# EAGLE design pcb (EAGLE 6.1)
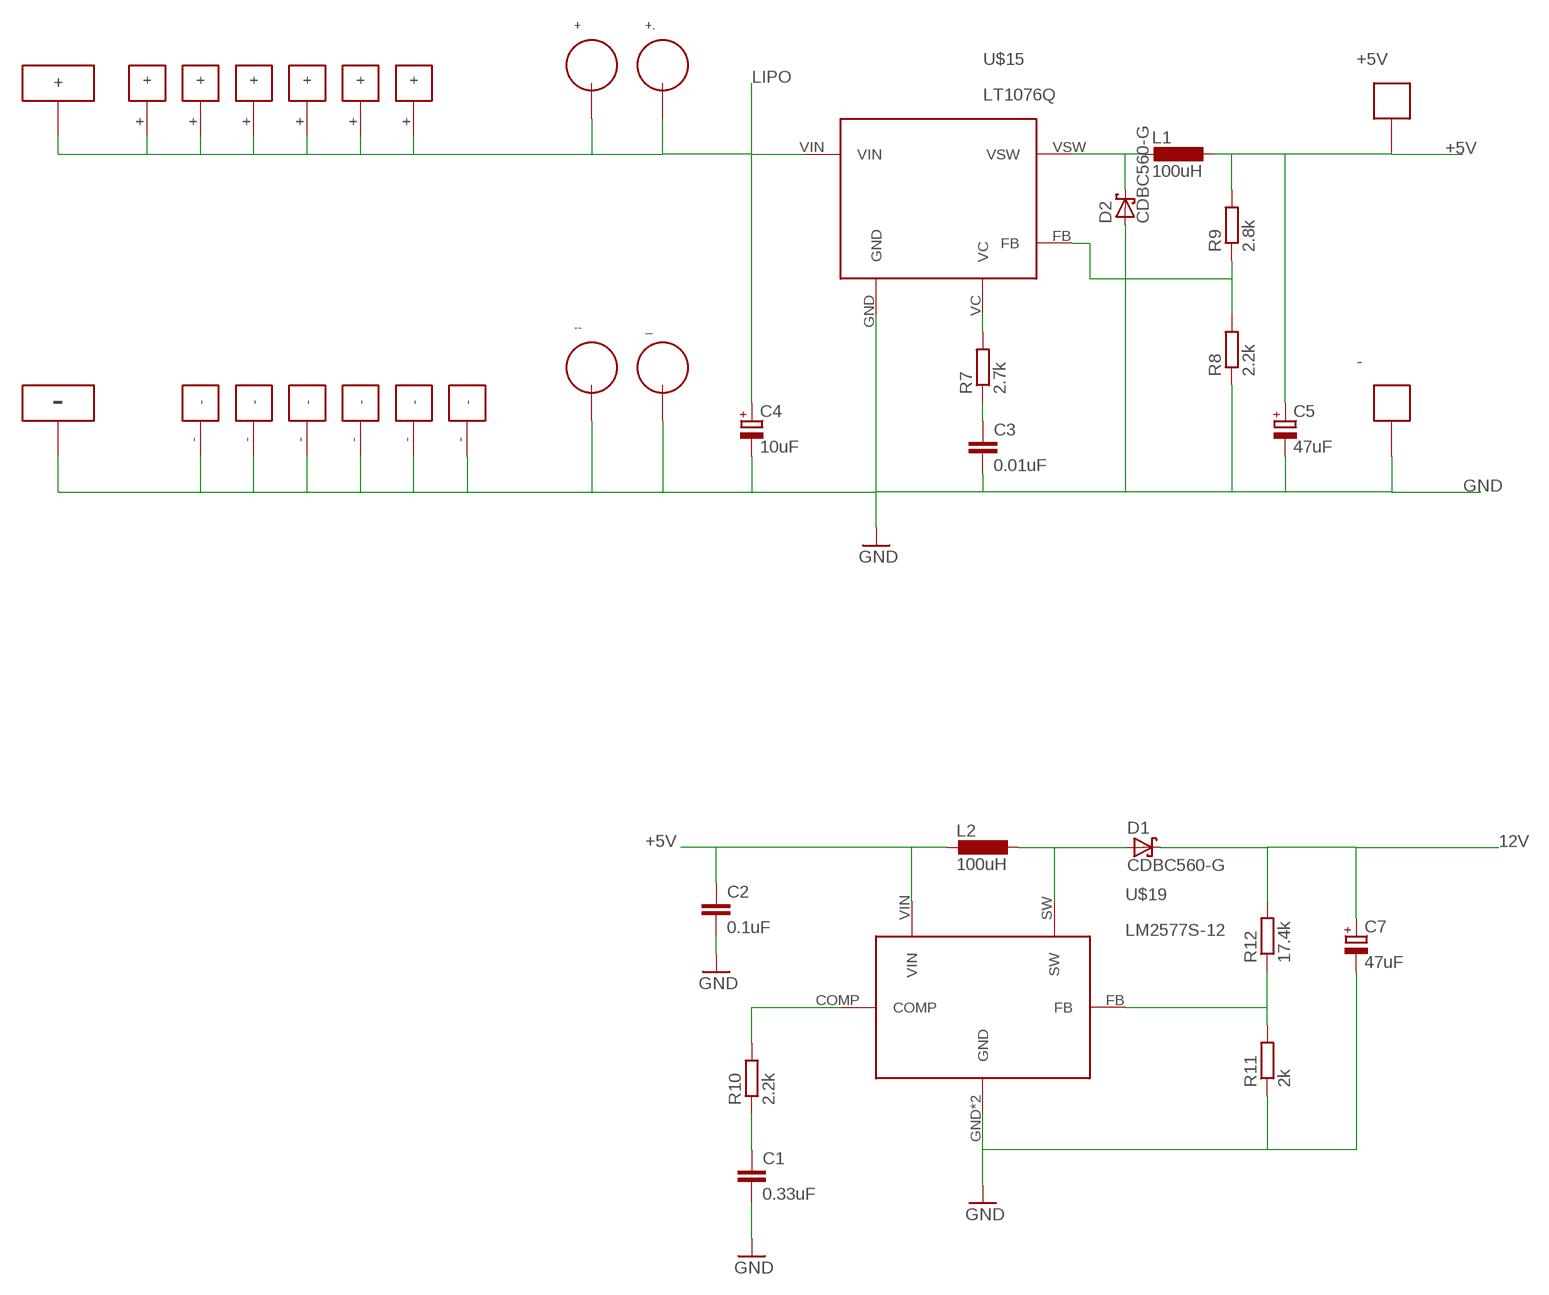
[diagram p0: schematic, sheet 1, part 1 of 2]
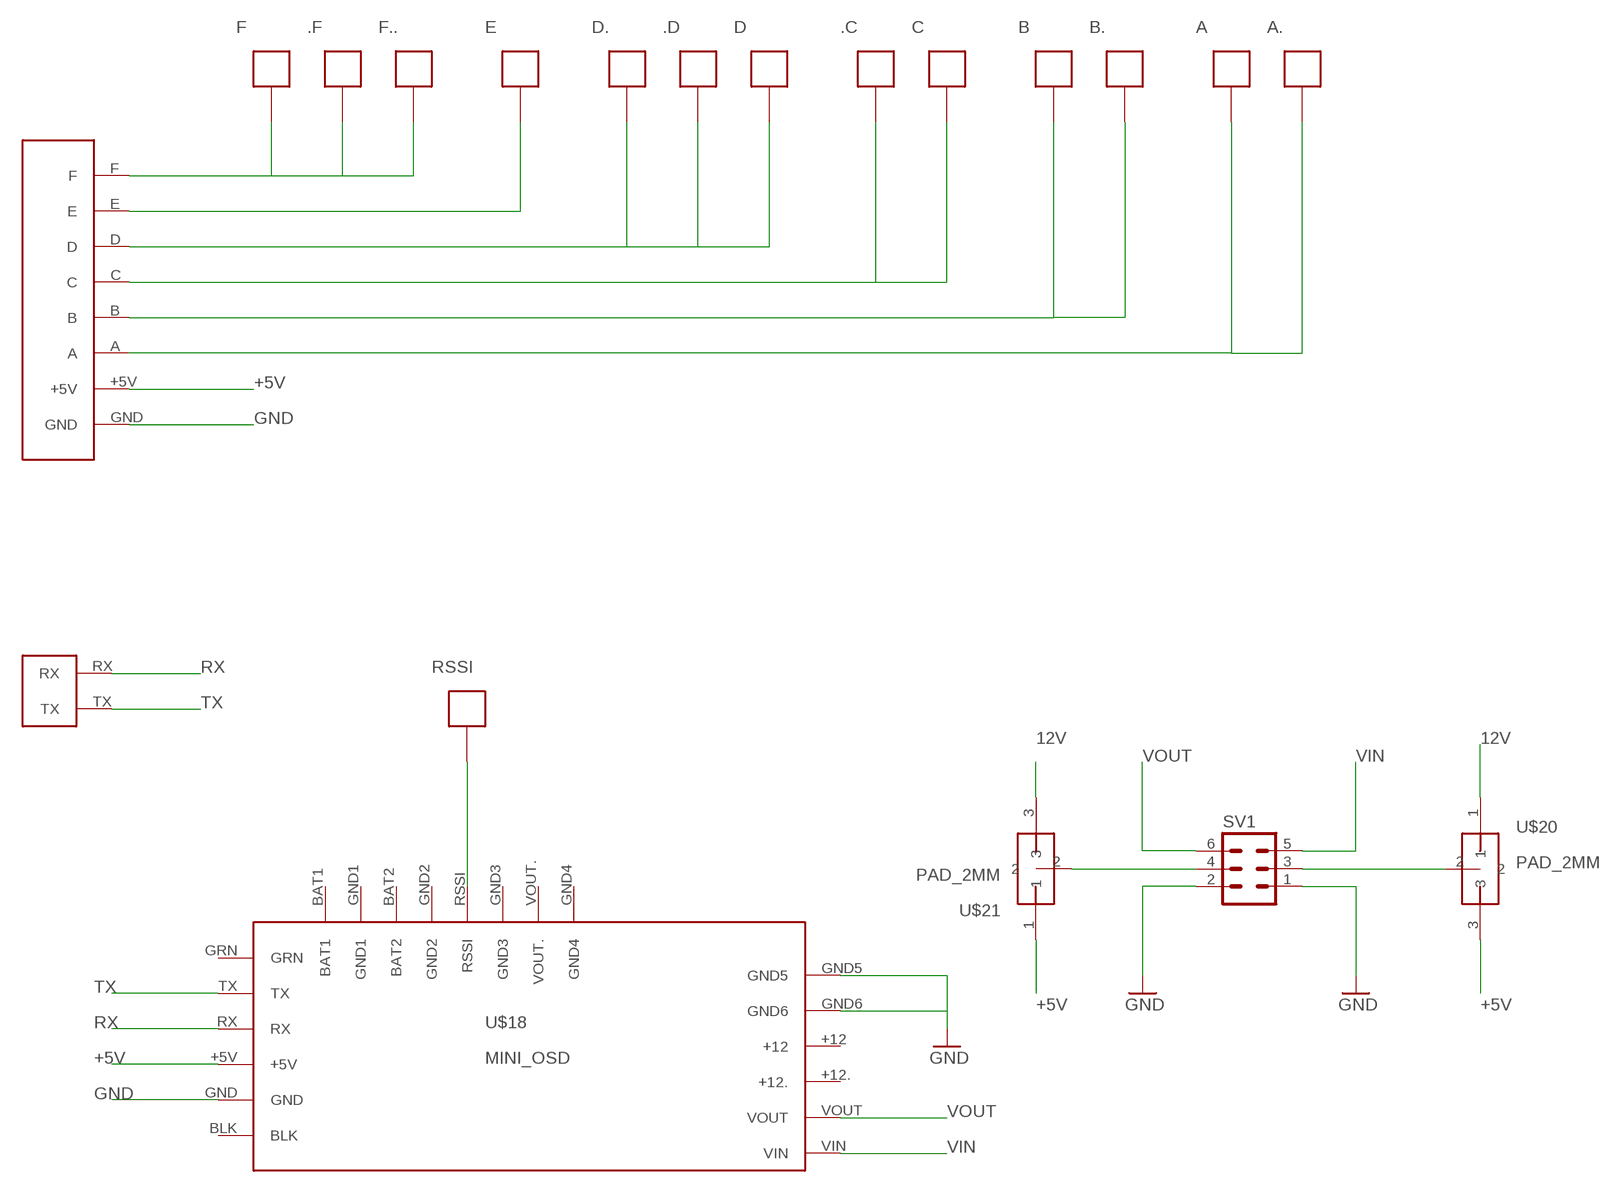
[diagram p1: schematic, sheet 1, part 2 of 2]

## Parts
+  PAD_POWER  [PAD_POWER]
+5V  PAD3-A  [PAD3-A]
+.  PAD_POWER  [PAD_POWER]
-  PAD3-A  [PAD3-A]
--  PAD_POWER  [PAD_POWER]
.C  PAD3-A  [PAD3-A]
.D  PAD3-A  [PAD3-A]
.F  PAD3-A  [PAD3-A]
_  PAD_POWER  [PAD_POWER]
A  PAD3-A  [PAD3-A]
A.  PAD3-A  [PAD3-A]
B  PAD3-A  [PAD3-A]
B.  PAD3-A  [PAD3-A]
C  PAD3-A  [PAD3-A]
C1  0.33uF  C-EUC1206  [C1206]
C2  0.1uF  C-EUC1206  [C1206]
C3  0.01uF  C-EUC1206  [C1206]
C4  10uF  CPOL-EU153CLV-0505  [153CLV-0505]
C5  47uF  CPOL-EU153CLV-0505  [153CLV-0505]
C7  47uF  CPOL-EU153CLV-0505  [153CLV-0505]
D  PAD3-A  [PAD3-A]
D1  CDBC560-G  MBRS320T3  [SMC]
D2  CDBC560-G  MBRS320T3  [SMC]
D.  PAD3-A  [PAD3-A]
E  PAD3-A  [PAD3-A]
F  PAD3-A  [PAD3-A]
F..  PAD3-A  [PAD3-A]
L1  100uH  DO3316P  [DO3316P]
L2  100uH  DO3316P  [DO3316P]
R7  2.7k  R-EU_R0805  [R0805]
R8  2.2k  R-EU_R0805  [R0805]
R9  2.8k  R-EU_R0805  [R0805]
R10  2.2k  R-EU_R0805  [R0805]
R11  2k  R-EU_R0805  [R0805]
R12  17.4k  R-EU_R0805  [R0805]
RSSI  PAD3-A  [PAD3-A]
SV1  MA03-2  [MA03-2]
U$1  PAD6X3.5-  [PAD6X3.5]
U$2  PAD6X3.5+  [PAD6X3.5]
U$3  PAD3.81+  [PAD3.81]
U$4  PAD3.81+  [PAD3.81]
U$5  PAD3.81-  [PAD3.81-]
U$7  PAD3.81+  [PAD3.81]
U$8  PAD3.81+  [PAD3.81]
U$9  PAD3.81-  [PAD3.81-]
U$10  PAD3.81-  [PAD3.81-]
U$11  PAD3.81-  [PAD3.81-]
U$12  PAD3.81-  [PAD3.81-]
U$13  PAD3.81+  [PAD3.81]
U$14  PAD3.81+  [PAD3.81]
U$15  LT1076Q  [LT1076]
U$16  2.54HEADER8  [2.54HEADER8]
U$17  2.54HEADER  [2.54HEADER]
U$18  MINI_OSD  [MINI_OSD]
U$19  LM2577S-12  [TO-263]
U$20  PAD_2MM  [PAD_2MM]
U$21  PAD_2MM  [PAD_2MM]
U$22  PAD3.81-  [PAD3.81-]

## Nets
12V: C7.+ D1.C R12.2 U$20.1 U$21.3
+5V: +5V.1 C2.1 C5.+ L1.2 L2.1 R9.2 U$16.+5V U$18.+5V U$19.VIN U$20.3 U$21.1
GND: --.P$1 --.P$2 --.P$3 --.P$4 --.P$5 --.P$6 --.P$7 --.P$8 --.P$9 -.1 _.P$1 _.P$2 _.P$3 _.P$4 _.P$5 _.P$6 _.P$7 _.P$8 _.P$9 C1.2 C2.2 C3.2 C4.- C5.- C7.- D2.A R8.1 R11.1 SV1.1 SV1.2 U$1.P$1 U$5.- U$9.- U$10.- U$11.- U$12.- U$15.GND U$16.GND U$18.GND U$18.GND5 U$18.GND6 U$19.GND U$19.GND1(GND) U$22.-
LIPO: +..P$1 +..P$2 +..P$3 +..P$4 +..P$5 +..P$6 +..P$7 +..P$8 +..P$9 +.P$1 +.P$2 +.P$3 +.P$4 +.P$5 +.P$6 +.P$7 +.P$8 +.P$9 C4.+ U$2.P$1(+) U$3.+ U$4.+ U$7.+ U$8.+ U$13.+ U$14.+ U$15.VIN
N$1: RSSI.1 U$18.RSSI
N$2: R10.2 U$19.COMP
N$3: .F.1 F.1 F...1 U$16.F
N$4: C3.1 R7.1
N$5: D2.C L1.1 U$15.VSW
N$6: R11.2 R12.1 U$19.FB
N$7: SV1.4 U$21.2
N$8: R8.2 R9.1 U$15.FB
N$9: R7.2 U$15.VC
N$10: E.1 U$16.E
N$11: SV1.3 U$20.2
N$12: .D.1 D.1 D..1 U$16.D
N$13: .C.1 C.1 U$16.C
N$14: B.1 B..1 U$16.B
N$15: C1.1 R10.1
N$16: A.1 A..1 U$16.A
N$17: D1.A L2.2 U$19.SW
RX: U$17.RX U$18.RX
TX: U$17.TX U$18.TX
VIN: SV1.5 U$18.VIN
VOUT: SV1.6 U$18.VOUT
Unconnected: U$18.+12 U$18.+12. U$18.BAT1 U$18.BAT2 U$18.BLK U$18.GND1 U$18.GND2 U$18.GND3 U$18.GND4 U$18.GRN U$18.VOUT.

## Library data of the parts
+ +. -- _ = PAD_POWER:PAD_POWER
+5V - .C .D .F A A. B B. C D D. E F F.. RSSI = pad3-A:PAD3-A
C1-C3 = resistor:C-EU: CAPACITOR, European symbol
C4 C5 C7 = resistor:CPOL-EU: POLARIZED CAPACITOR, European symbol
D1 D2 = diode:MBRS3*0T3: SCHOTTKY BARRIER RECTIFIER 3.0 AMPERES 20, 30, 40 VOLT Source: MBRS340T3-D.pdf
L1 L2 = inductor-coilcraft:DO3316P: COILCRAFT; OC_FARNELL: unknown; OC_NEWARK: unknown
R7-R12 = resistor:R-EU_: RESISTOR, European symbol
SV1 = con-lstb:MA03-2: PIN HEADER; OC_FARNELL: unknown; OC_NEWARK: unknown
U$1 = PAD6X3.5-:PAD6X3.5-
U$2 = PAD6X3.5+:PAD6X3.5+
U$3 U$4 U$7 U$8 U$13 U$14 = pad3.81:PAD3.81+
U$5 U$9-U$12 U$22 = pad3.81-:PAD3.81-
U$15 = LT1076:LT1076Q
U$16 = 2.54HEADER8:2.54HEADER8
U$17 = 2.54header:2.54HEADER
U$18 = mini_osd:MINI_OSD
U$19 = LM2577S-12:LM2577S-12
U$20 U$21 = PAD_2MM:PAD_2MM

## Board
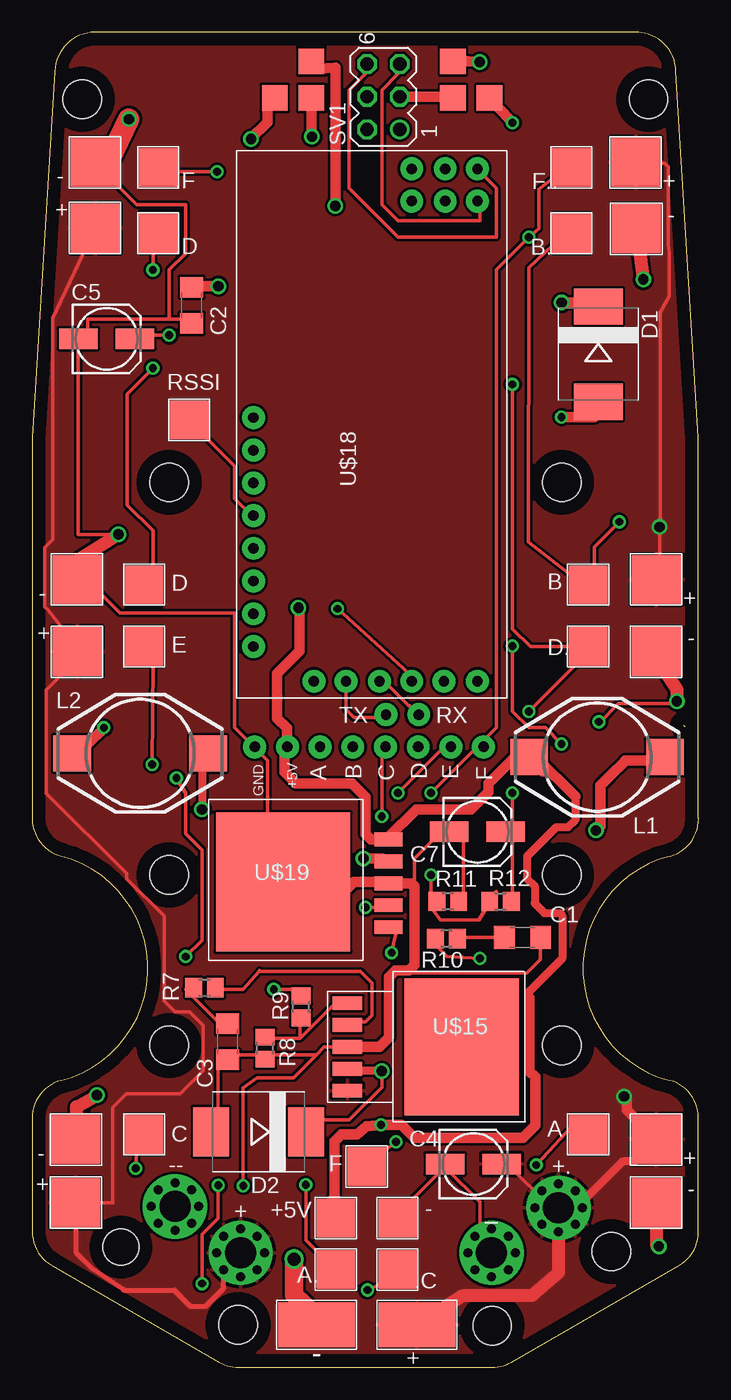
[diagram p2: board, top side]
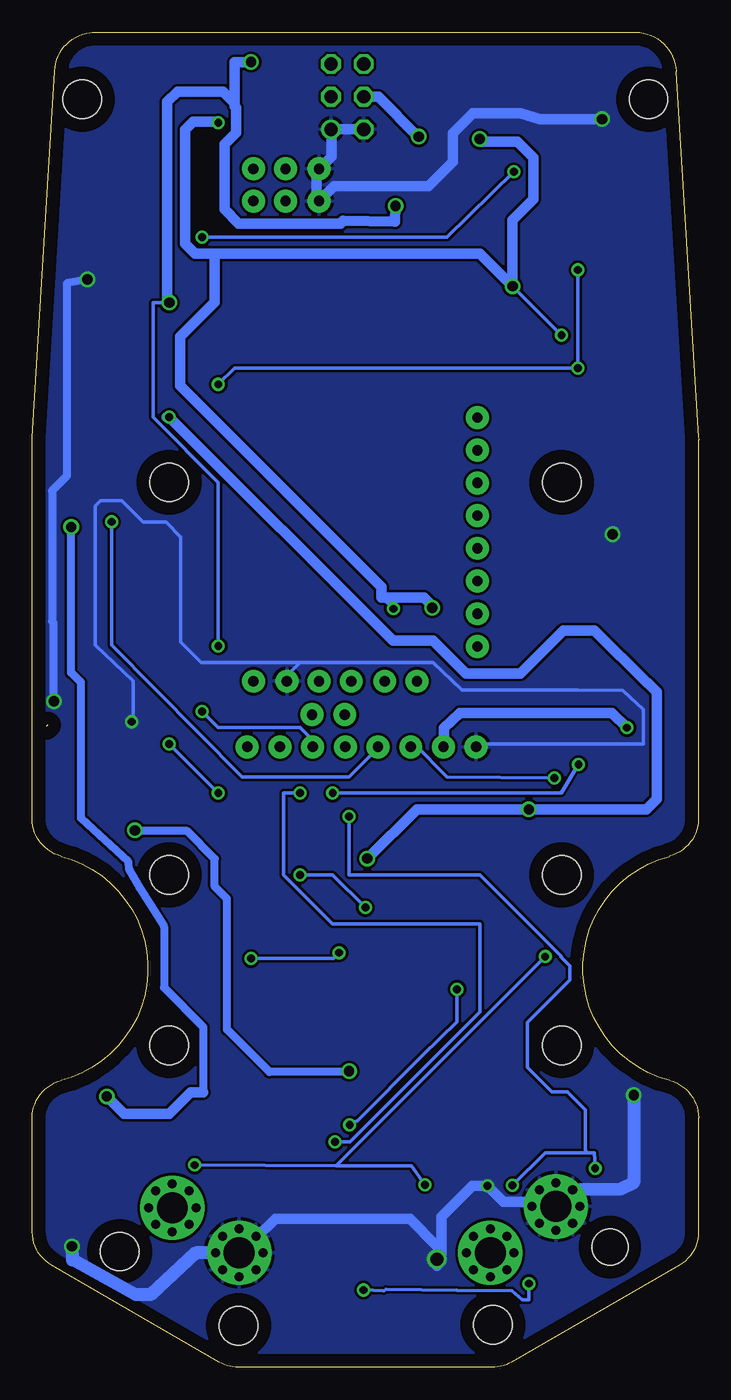
[diagram p3: board, bottom side, seen from below]

Size 51.78 x 103.71 mm. Coordinates in mm from the lower left corner, seen from the top.
Outline: 1.76,100.69 0.01,72.21 arc4 0,72.01
Outline: 47.12,103.71 4.86,103.71 arc86 1.75,100.69
Outline: 51.77,72.21 50.02,100.69 arc86 47.02,103.7
Outline: 51.77,42.62 51.77,72.01 arc4 51.77,72.21
Outline: 51.77,10.52 51.77,19.38 arc75 49.54,22.28
Outline: 37.25,0.41 50.28,7.92 arc60 51.77,10.52
Outline: 16.04,0 35.75,0 arc30 37.25,0.4
Outline: 1.51,7.92 14.54,0.41 arc30 16.04,0
Outline: 0.01,19.38 0.01,10.52 arc60 1.51,7.92
Outline: 0.01,72.01 0.01,42.62 arc75 2.25,39.72
Outline: 51.78,42.62 arc-76 49.54,39.7 arc151 49.54,22.28
Outline: 0,19.38 arc-75 2.24,22.28 arc151 2.24,39.7
Outline: 50.59,49.89 50.69,49.79
Copper layers (1*16): Top 0.035mm / dielectric 1.5mm / Bottom 0.035mm
Design rules: minimum track width 10mil, minimum drill 24mil, track to track 8mil, track to pad 8mil, pad to pad 8mil, via to via 8mil, smd to smd 8mil, copper to edge 40mil, drill to drill 8mil, minimum pad ring 10mil, minimum via ring 8mil, stop-mask expansion 4mil, vias tented up to drill 0mil, thermal gap 10mil
Holes 2.8 mm at 6.89,9.34
Holes 3 mm at 15.99,3.29 35.74,3.24 44.99,8.99 41.14,24.99 41.14,38.24 10.64,38.24 10.64,24.99 10.64,68.74 41.14,68.74 47.89,98.49 3.89,98.49

### Footprints (pad centres in the part's own frame; a part is rotated, then mirrored left to right if it is on the bottom)
PAD_POWER = drill 2.4 pad 5: P$1 0,0 | drill 0.7 pad 1: P$2 -1.3,-1.3; P$3 0,-1.85; P$4 1.3,-1.3; P$5 1.85,0; P$6 1.3,1.3; P$7 0,1.85; P$8 -1.3,1.3; P$9 -1.85,0
PAD3-A = smd 3 x 3: 1 0,0
C1206 = smd 1.6 x 1.8: 1 -1.4,0; 2 1.4,0
153CLV-0505 = smd 3 x 1.6: + 2.2,0; - -2.2,0
SMC = smd 2.8 x 3.8: A 3.7,0; C -3.7,0
DO3316P = smd 2.92 x 2.79: 1 -5.28,0; 2 5.28,0
R0805 = smd 1.3 x 1.5: 1 -0.85,0; 2 0.85,0
MA03-2 = drill 1.016: 1 -2.54,-1.27 | drill 1.016 octagon: 2 -2.54,1.27; 3 0,-1.27; 4 0,1.27; 5 2.54,-1.27; 6 2.54,1.27
PAD6X3.5 = smd 6 x 3.5: P$1 0,0
PAD3.81 = smd 3.81 x 3.81: + 0,0
PAD3.81- = smd 3.81 x 3.81: - 0,0
LT1076 = smd 1.067 x 2.286: FB -3.404,0; GND 0,0; VC -1.702,0; VIN 3.404,0; VSW 1.702,0 | smd 10.668 x 8.89: P$6 0,8.89
2.54HEADER8 = drill 0.8 pad 1.778: +5V 2.54,0; A 5.08,0; B 7.62,0; C 10.16,0; D 12.7,0; E 15.24,0; F 17.78,0; GND 0,0
2.54HEADER = drill 0.8 pad 1.778: RX 2.54,0; TX 0,0
MINI_OSD = drill 0.8 pad 1.778: +5V -2.7,-12.3; +12 34.6,-14.9; +12. 37.1,-14.9; BAT1 0,0; BAT2 5.08,0; BLK -2.7,-17.4; GND -2.7,-14.8; GND1 2.54,0; GND2 7.62,0; GND3 12.7,0; GND4 17.78,0; GND5 34.6,-12.3; GND6 37.1,-12.3; GRN -2.7,-4.7; RSSI 10.16,0; RX -2.7,-9.8; TX -2.7,-7.2; VIN 34.6,-17.4; VOUT 37.1,-17.4; VOUT. 15.24,0
TO-263 = smd 1.07 x 2.16: COMP -3.4,0; FB -1.7,0; GND 0,0; SW 1.7,0; VIN 3.4,0 | smd 10.8 x 10.41: GND1 0.1,8.2
PAD_2MM = smd 2 x 2: 1 0,2.84; 2 0,0; 3 2.84,0

### Placement (x,y rotation side)
+  16.19,8.89 0 top
+5V  23.59,11.59 0 top
+.  40.89,12.39 0 top
-  28.39,11.59 0 top
--  11.09,12.49 0 top
.C  28.39,7.59 0 top
.D  9.79,88.09 0 top
.F  9.79,93.19 0 top
_  35.69,8.89 0 top
A  43.19,18.09 0 top
A.  23.59,7.59 0 top
B  43.19,60.79 0 top
B.  41.89,88.09 0 top
C  8.69,18.09 0 top
C1  38.09,33.39 0 top
C2  12.39,82.49 270 top
C3  15.19,25.29 270 top
C4  34.29,15.79 0 top
C5  5.79,79.89 0 top
C7  34.59,41.59 0 top
D  8.69,60.79 0 top
D1  43.99,78.69 270 top
D2  17.59,18.29 180 top
D.  43.19,55.99 0 top
E  8.69,55.99 0 top
F  25.99,15.59 0 top
F..  41.89,93.19 0 top
L1  43.89,47.39 180 top
L2  8.39,47.69 0 top
R7  13.39,29.49 0 top
R8  18.09,24.79 90 top
R9  20.89,27.99 90 top
R10  32.19,33.29 180 top
R11  32.29,36.19 180 top
R12  36.39,36.19 0 top
RSSI  12.19,73.59 0 top
SV1  27.29,98.69 90 top
U$1  22.09,3.29 0 top
U$2  29.89,3.29 0 top
U$3  3.39,12.79 0 top
U$4  48.49,17.69 180 top
U$5  3.39,17.69 0 top
U$7  3.49,55.59 0 top
U$8  4.89,88.49 0 top
U$9  3.49,61.19 0 top
U$10  4.89,93.59 0 top
U$11  48.49,12.79 180 top
U$12  48.49,55.59 180 top
U$13  46.89,93.59 180 top
U$14  48.49,61.19 180 top
U$15  24.49,24.89 270 top
U$16  17.29,48.19 0 top
U$17  27.49,50.69 0 top
U$18  17.19,55.99 90 top
U$19  27.69,37.59 90 top
U$20  32.69,98.59 0 top
U$21  21.69,98.59 90 top
U$22  46.94,88.44 180 top

### Tracks (layer width: path | path; a pad name or v marks a point on that pad's centre or on a via)
12V  (via drill 0.61, 0.8)
  Top 0.254: 37.32,42.06 37.32,36.98 R12.2 | 22.08,100.88 U$21.3 | 43.67,82.7 D1.C | v37.32,44.6 37.32,42.06 | v41.13,48.41 39.86,49.68 38.59,49.68 37.32,50.95 v37.32,56.03 | 37.32,42.06 C7.+
  Top 0.813: 22.08,100.88 23.55,100.93 v23.55,90.2 | v41.13,82.7 43.67,82.7 | U$20.1 33.83,101.43 v34.78,101.38
  Bottom 0.254: v41.13,48.41 v37.32,44.6 | v37.32,56.03 37.32,68.73 42.4,73.81 42.4,82.7 v41.13,82.7
  Bottom 0.813: v23.55,90.2 23.6,89 27.63,89.05 27.84,88.84 35.74,88.84 36.84,89.94 36.84,94.99 35.94,95.89 35.94,97.83 36.05,97.94 36.05,98.2 | 36.05,98.2 36.05,101.38 v34.78,101.38 | 36.05,98.2 36.94,99.09 40.49,99.09 41.29,98.29 41.29,82.89 41.13,82.73 v41.13,82.7
+5V  (via drill 0.61, 0.8)
  Top 0.254: v18.77,29.36 20.81,29.36 R9.2 | 23.35,12.85 +5V.1 | 39.69,46.36 38.9,46.93 38.59,47.14 L1.2 | 4.3,48.41 L2.1 | 39.08,18.8 39.09,18.79 | 13.19,83.97 C2.1 | 36.05,97.94 U$20.3 | 18.27,97.94 U$21.1 | v10.65,80.16 8.11,80.16 C5.+ | v23.72,58.92 29.7,53.49 U$18.+5V | 27.16,40.79 U$19.VIN | v5.57,49.68 v5.58,49.68
  Top 0.61: 42.19,44.34 42.19,42.49 41.64,41.94 40.69,41.94 38.44,39.69 38.44,37.99 39.04,37.39 39.04,36.04 39.79,35.29 40.99,35.29 41.19,35.09 41.19,31.74 38.59,29.14 38.59,28.69 38.64,28.69
  Top 0.813: v14.46,83.97 13.19,83.97 | 4.3,48.41 4.31,48.41 v5.58,49.68 5.59,49.69 | U$16.+5V 19.69,48.34 19.59,47.94 19.59,46.24 20.49,45.34 24.84,45.34 25.89,44.29 25.89,41.44 26.34,40.99 U$19.VIN 27.69,41.19 29.84,43.34 34.09,43.34 35.44,44.69 35.44,45.34 37.39,47.29 38.51,47.29 L1.2 | U$16.+5V 19.76,48.19 19.54,48.41 19.61,48.41 | 19.61,48.41 U$16.+5V | 19.61,48.41 19.62,48.41 19.74,48.29 19.74,48.19 19.79,48.14 19.79,48.21 19.81,48.21 U$16.+5V | v20.69,58.99 20.79,58.89 20.79,55.64 19.04,53.89 19.04,50.39 19.79,49.64 19.79,48.23 U$16.+5V | 18.27,97.94 18.27,96.72 16.94,95.39 v16.99,95.39 v17,95.4 | 36.05,97.94 36.09,97.94 37.34,96.69 v37.32,96.67 | 39.69,46.29 39.69,46.36 39.69,46.39 38.74,47.34 38.74,47.29 38.89,47.14 | 23.35,12.85 23.35,13 23.49,13.14 23.49,17.54 24.04,18.09 25.24,18.09 25.96,18.71 v27.11,18.82 27.11,18.84 28.69,18.84 29.69,17.84 38.14,17.84 39.09,18.79 39.09,22.54 38.64,22.99 38.64,28.69 | 42.19,44.34 39.19,47.34 39.19,47.22 38.9,46.93
  Bottom 0.254: v14.46,83.97 v10.65,80.16 | 24.64,59.79 v23.72,58.92 | v18.77,29.36 18.77,27.56 18.79,26.84 21.44,24.24 26.49,19.14 27.19,18.89 27.09,18.79 27.09,18.8 v27.11,18.82 | 19.79,48.41 19.54,48.41 U$16.+5V
  Bottom 0.813: 19.79,48.21 19.79,48.41 19.79,49.64 18.54,50.84 6.73,50.84 v5.57,49.68 v5.58,49.68 5.59,49.69 | v20.69,58.99 20.69,59.14 21.34,59.79 24.64,59.79 24.64,60.59 40.29,76.24 40.29,80.04 37.59,82.74 37.59,86.34 37.69,86.44 37.69,86.51 | v17,95.4 16.79,95.19 14.09,95.19 12.84,93.94 12.84,90.74 14.46,89.12 v14.46,83.97 17,86.51 37.69,86.51 | 37.69,86.51 39.11,86.51 39.89,87.29 39.89,96.14 39.29,96.74 37.44,96.74 37.34,96.64 v37.32,96.66 v37.32,96.67
GND  (via drill 0.61, 0.8, 1)
  Top 0.254: 48.75,12.85 U$11.- 47.98,12.18 47.48,11.58 | 18.27,24.28 15.73,24.28 C3.2 14.46,24.28 14.46,19.2 D2.A | 10.65,81.43 4.3,81.43 4.3,80.16 C5.- | 10.65,81.43 11.92,81.43 C2.2 | 3.03,62.38 U$9.- 4.3,61.11 6.84,58.57 15.73,58.57 15.73,49.68 17,48.41 | 3.03,80.16 C5.- | 10.65,81.43 10.65,85.24 11.92,86.51 11.92,90.32 8.11,90.32 5.57,92.86 U$10.- | R11.1 33.51,35.71 33.51,42.06 C7.- 32.24,42.06 29.7,39.52 29.7,37.85 29.44,37.59 | 29.7,30.63 38.43,30.63 39.49,31.69 C1.2 39.49,32.99 | 29.7,30.7 29.7,30.63 | 17,48.41 18.27,47.14 18.27,38.25 U$19.GND1 19.54,36.98 24.28,36.98 | 17,48.41 U$16.GND | v16.4,14.09 16.4,21.7 17.49,22.49 20.29,22.49 22.08,24.28 | 22.08,24.28 22.69,24.89 U$15.GND | -.1 28.39,11.89 32.19,15.69 C4.- 32.24,15.39 34.78,12.85 34.78,10.31 _.P$1 | 22.08,3.96 U$1.P$1 | 47.48,56.6 47.48,56.03 U$12.- 48.49,55.54 47.79,54.84 | 22.08,24.28 18.27,24.28 | 18.27,24.28 R8.1 | v44.04,50.14 44.14,50.14 45.54,51.54 49.54,51.54 49.69,51.69 50.04,51.69 | 50.04,51.69 50.09,51.69 | v50.09,51.74 50.04,51.69 | U$22.- 47.69,87.69 | C5.- 3.59,64.69 v6.69,64.69 | 29.7,30.63 28.43,30.63 28.43,30.84 | U$19.GND 27.79,37.59 27.69,37.69 26.69,37.69 26.79,37.59 U$19.GND
  Top 0.813: 26.69,37.69 24.99,37.69 24.28,36.98 24.19,36.89 | 27.79,37.59 29.44,37.59 | 29.44,37.59 29.69,37.34 | 29.69,37.34 29.7,37.33 29.7,37.29 | U$15.GND 26.99,24.89 27.74,25.64 27.74,30.34 28.24,30.84 28.43,30.84 29.29,30.84 29.69,31.24 29.69,37.29 | 29.69,37.29 29.69,37.34 | 29.44,37.59 29.44,37.54 29.69,37.29
  Top 1.016: v48.69,9.39 48.54,9.39 48.54,11.59 47.98,12.18 | U$5.- 3.44,20.24 v5.04,21.14 | 47.48,56.6 50.09,52.64 v50.09,51.74 | U$22.- v47.49,84.49 | 3.03,62.38 v6.69,64.69
  Top 1.422: 22.08,3.96 20.34,5.65 v20.34,8.4
  Top 1.676: 5.57,92.86 v7.51,96.95
  Bottom 0.254: 33.51,9.04 _.P$9 | 13.19,12.85 --.P$5 | 29.7,92.86 U$18.GND6 | 30.97,54.76 32.24,53.49 U$18.GND | U$16.GND 17,48.41 4.3,48.41 4.3,51.08 5.89,52.57 9.39,52.59 18.39,52.59 20.66,54.76 30.97,54.76 | 30.97,54.76 38.66,54.76 40.24,56.34 40.24,64.49 41.39,65.64 43.14,65.64 44.84,67.34 46.44,67.34 46.89,66.89 46.89,56.09 43.94,53.29 43.94,50.24 v44.04,50.14
  Bottom 0.406: v20.34,8.4 20.34,9.49 | 34.39,10.24 _.P$8
  Bottom 0.61: v47.49,84.49 49.09,84.19 49.09,69.24 50.24,68.09 50.24,57.94 50.14,57.84 50.14,51.74 v50.09,51.74
  Bottom 0.813: v7.51,96.95 12.35,96.95 13.84,97.39 17.54,97.39 19.09,95.84 19.09,93.64 20.99,91.74 28.34,91.74 U$18.GND5 | 29.54,90.54 U$18.GND5 | SV1.2 28.48,96.15 28.54,96.09 28.54,94.04 U$18.GND6 | 29.7,92.86 29.7,90.8 U$18.GND5 | 13.19,12.85 15.16,12.85 v16.4,14.09 17.59,14.09 19.99,11.69 19.99,8.24 20.34,7.89 v20.34,8.4 | 20.34,9.49 20.39,9.49 22.44,11.54 32.89,11.54 34.34,10.09 34.34,10.14 _.P$8
  Bottom 1.016: _.P$8 _.P$7 _.P$6 _.P$5 | _.P$5 _.P$4 35.69,7.09 | 35.69,7.09 _.P$2 _.P$9 | _.P$5 39.09,8.89 42.59,5.64 43.74,5.64 48.64,8.34 v48.69,9.39 | 13.19,12.85 --.P$4 11.14,10.59 11.04,10.59 | 11.04,10.59 --.P$2 --.P$9 --.P$8 --.P$7 | 11.04,10.59 --.P$3 | --.P$6 12.49,13.74 --.P$5 | v5.04,21.14 5.04,14.34 6.09,13.84 9.99,13.79 --.P$1 | _.P$1 35.69,7.09 | 35.69,7.09 _.P$3 | v6.69,64.69 6.64,64.84
  pour Bottom: 1.79,100.29 1.79,100.44 arc-90 4.89,103.54 46.89,103.54 arc-90 49.99,100.44 51.69,72.84 51.69,42.29 51.69,42.19 arc-90 49.14,39.64 49.09,39.64 48.84,39.39 arc-14 45.04,36.44 43.04,32.49 43.84,26.89 47.64,23.14 50.49,21.99 arc-90 51.79,20.69 51.79,9.09 50.59,7.74 36.49,-0.16 15.14,-0.16 0.04,8.64 0.14,20.99 6.04,24.44 8.69,28.84 8.49,33.59 5.69,37.79 1.54,39.94 arc-90 -0.01,41.49 -0.01,45.89 -0.01,73.44 arc-8
LIPO  (via drill 0.8)
  Top 0.254: +..P$2 39.86,11.58 +..P$1 | 41.13,11.58 41.13,10.31 +..P$3 | 41.13,11.58 42.4,11.58 +..P$4 | 41.13,11.58 +..P$1 | 42.4,12.85 +..P$5 | 41.13,14.12 39.86,14.12 +..P$8 | 41.13,14.12 +..P$1 | 41.13,14.12 42.4,14.12 +..P$6 | 41.13,14.12 +..P$7 | 39.86,12.85 37.32,15.39 C4.+ | 47.48,16.66 U$4.+ | U$14.+ 48.75,61.11 v48.75,65.27 48.79,65.31 48.79,81.94 49.49,83.19 49.49,86.59 49.44,87.19 49.44,93.24 49.14,93.54 46.84,93.54 U$13.+ | U$8.+ 1.59,81.49 1.59,64.29 0.99,63.69 0.99,59.04 1.19,58.84 3.49,55.89 U$7.+ 3.79,55.29 1.09,52.59 1.09,44.59 7.34,38.34 7.34,37.94 10.24,35.04 10.24,28.44 11.09,27.59 12.24,27.59 13.29,26.54 13.29,23.04 11.49,21.24 7.29,21.24 6.24,20.19 6.24,12.79 U$3.+
  Top 0.406: U$3.+ 3.39,8.94 4.69,7.64 7.04,6.09 7.14,5.99 11.04,5.99 12.24,4.79 12.24,4.74 13.49,4.74 14.89,6.14 +.P$2
  Top 0.61: 47.48,16.66 46.81,15.99 45.89,15.99 42.74,12.84 42.74,12.34 42.19,11.79 +..P$4 | +.P$8 15.39,10.69 16.19,10.69 16.69,10.19 +.P$6 | +.P$4 16.94,7.04 +.P$3 | 42.4,12.85 41.99,12.44 40.89,12.44 | 40.89,12.44 40.89,13.09 | 39.86,12.85 40.27,12.44 40.89,12.44 | 40.89,12.44 +..P$1 40.99,12.49 40.99,12.84 | 40.89,14.04 40.94,13.99 40.94,12.49 | 41.13,12.85 40.89,13.09 | 40.89,13.09 40.89,14.04 | 40.89,14.39 40.89,14.04
  Top 0.813: v45.99,21.04 46.19,21.04 46.19,19.99 U$4.+
  Top 1.016: U$2.P$1 33.39,5.54 33.54,5.59 38.84,5.59 40.74,7.24 40.89,7.34 +..P$3
  Bottom 0.254: 41.13,14.12 +..P$1
  Bottom 0.61: 38.44,21.34 38.49,21.34 38.49,26.44 41.54,29.49 41.54,34.24 43.44,37.24 44.24,38.64 44.29,39.24 47.99,42.64 47.99,53.19 48.75,53.95 v48.75,65.27
  Bottom 0.813: 38.49,21.34 39.49,21.34 41.14,19.69 44.64,19.69 v45.99,21.04
  pour Top: 1.74,100.24 1.74,100.39 arc-90 4.84,103.49 46.84,103.49 arc-90 49.94,100.39 51.64,72.79 51.64,42.24 51.64,42.14 arc-90 49.09,39.59 49.04,39.59 48.79,39.34 arc-14 44.99,36.39 42.99,32.44 43.79,26.84 47.59,23.09 50.44,21.94 arc-90 51.74,20.64 51.74,9.04 50.54,7.69 36.44,-0.21 15.09,-0.21 -0.01,8.59 0.09,20.94 5.99,24.39 8.64,28.79 8.44,33.54 5.64,37.74 1.49,39.89 arc-90 -0.06,41.44 -0.06,45.84 -0.06,73.39 arc-8
N$1
  Top 0.254: RSSI.1 13.19,72.54 15.73,70 15.73,67.46 17,66.19 U$18.RSSI
N$2  (via drill 0.61)
  Top 0.254: v34.78,31.75 32.24,31.9 30.97,33.17 R10.2 | v27.93,32.2 28.43,34.44 U$19.COMP
  Bottom 0.254: v34.78,31.75 28.38,31.75 v27.93,32.2
N$3  (via drill 0.61)
  Top 0.254: v14.36,92.86 10.65,92.86 .F.1 | F...1 41.13,92.86 39.36,91.49 39.36,88.45 v38.59,87.78 36.05,85.24 36.05,49.68 34.78,48.41 | v28.26,17.5 27.16,16.66 F.1 | 34.78,48.41 v30.97,44.6 | 34.78,48.41 U$16.F
  Bottom 0.254: v14.36,92.86 19.54,87.78 v38.59,87.78 | v30.97,44.6 32.24,44.6 32.24,38.25 28.43,34.44 17,34.44 17,28.86 16.99,28.87 | v28.26,17.5 27.08,17.5 16.99,27.59 16.99,28.87 | 16.99,28.87 16.99,28.89
N$4
  Top 0.254: R7.1 11.92,29.36 14.46,26.82 C3.1
N$5  (via drill 0.8)
  Top 0.254: v27.16,23.01 27.16,21.74 24.62,19.2 22.08,19.2 D2.C | 24.62,23.01 U$15.VSW | v43.8,41.69 v43.8,41.7 43.67,42.06 | 48.75,47.14 L1.1 | 44.89,45.92 44.88,45.93
  Top 0.61: v27.16,23.01 24.62,23.01 | 46.04,47.07 46.09,47.14 | 43.84,41.69 44.14,41.99
  Top 0.813: 48.75,47.14 46.09,47.14 | 44.88,45.93 44.14,45.19 44.14,41.99 | 43.84,41.69 v43.81,41.69 v43.8,41.7 | 44.89,45.92 46.04,47.07
  Bottom 0.61: v27.16,23.01 27.23,22.94 33.34,22.94 36.64,26.24 36.64,36.39 37.59,37.34 37.59,39.49 39.74,41.64 43.79,41.64 43.8,41.65 v43.8,41.7
N$6  (via drill 0.61)
  Top 0.254: 30.97,35.71 31.74,34.74 34.71,34.74 36.05,36.98 R12.1 | v25.89,35.71 27.16,35.71 U$19.FB | 30.97,35.71 v30.97,38.25 | 30.97,35.71 R11.2
  Bottom 0.254: v25.89,35.71 28.43,38.25 v30.97,38.25
N$7  (via drill 0.8)
  Top 0.813: U$21.2 21.69,95.64 v21.74,95.59
  Bottom 0.813: SV1.4 24.89,98.69 21.79,95.59 v21.74,95.59
N$8
  Top 0.254: 20.81,25.55 18.27,25.55 R8.2 | 20.81,25.55 20.81,26.82 R9.1 | 20.81,25.55 23.35,28.09 U$15.FB
N$9
  Top 0.254: 17.67,30.83 17.61,30.76 | 17.61,30.76 16.4,29.36 14.46,29.36 R7.2 | U$15.VC 24.62,26.82 25.89,26.82 25.89,26.84 26.39,27.34 26.39,29.84 25.49,30.74 17.63,30.74 17.61,30.76
N$10  (via drill 0.61)
  Top 0.254: v9.33,46.82 9.38,54.76 E.1 | v28.43,44.6 32.24,48.41 U$16.E
  Bottom 0.254: v9.33,46.82 10.65,44.6 v28.43,44.6
N$11
  Top 0.254: 32.24,99.21 U$20.2
  Top 0.813: SV1.3 32.64,98.69 32.69,98.64 U$20.2
N$12  (via drill 0.61)
  Top 0.254: v38.59,50.95 42.4,54.76 D..1 42.4,56.03 42.4,56.08 42.39,56.09 42.29,55.99 38.69,55.99 37.32,57.36 v37.32,76.35 | v9.38,85.24 9.38,87.78 .D.1 | D.1 9.38,61.11 9.38,65 7.39,66.99 7.39,75.59 9.39,77.59 v9.39,77.61 v9.38,77.62
  Bottom 0.254: v38.59,50.95 37.32,49.68 30.97,49.68 29.7,48.41 U$16.D | v9.38,85.24 v9.38,77.62 36.05,77.62 v37.32,76.35
N$13  (via drill 0.61)
  Top 0.254: v26.04,6 27.16,6.5 .C.1 | v8.04,15.44 8.11,16.66 8.11,17.93 C.1 | v27.16,42.78 27.16,48.41 U$16.C | v13.19,6.5 13.19,10.31 14.46,11.58 v14.46,14.12
  Bottom 0.254: v26.04,6 24.47,5.93 24.44,5.94 24.29,6.04 18.79,5.99 14.49,5.94 13.69,5.24 13.19,5.23 v13.19,6.5 | v27.16,42.78 27.16,38.25 17,38.25 10.65,31.9 10.68,31.9 10.69,31.89 9.99,31.19 9.99,30.09 13.29,26.79 13.29,23.29 11.39,21.39 10.19,21.39 8.79,19.99 8.79,16.86 8.59,16.66 | v8.04,15.44 8.11,16.66 8.59,16.66 | v14.46,14.12 11.92,16.66 8.59,16.66
N$14  (via drill 0.61)
  Top 0.254: B..1 41.13,87.78 38.61,85.41 38.56,64.1 42.4,61.11 B.1 43.67,61.11 43.67,63.73 v45.61,65.67
  Bottom 0.254: U$16.B 24.62,48.41 27.16,45.87 35.48,45.87 45.61,56.1 45.61,65.61 45.69,65.69 45.63,65.69 v45.61,65.67
N$15
  Top 0.254: C1.1 33.14,33.39 R10.1
N$16  (via drill 0.61)
  Top 0.254: v21.26,14.17 21.26,9.86 23.35,7.77 A..1 | v39.16,15.71 42.4,19.2 A.1 | v11.2,45.77 11.92,44.6 11.92,41.46 13.19,40.19 13.19,33.17 v11.92,31.9
  Bottom 0.254: v21.26,14.17 22.3,15.66 28.16,15.66 | v39.16,15.71 28.16,15.66 | v11.2,45.77 19.54,45.87 22.08,48.41 U$16.A | 28.16,15.66 v11.92,31.9
N$17  (via drill 0.61, 0.8)
  Top 0.254: 27.16,39.52 U$19.SW | 13.19,47.14 L2.2 | 43.67,73.81 D1.A | v41.13,73.81 41.15,73.8
  Top 0.61: 13.19,47.14 v13.19,43.33
  Top 0.813: 43.67,73.81 41.16,73.81 41.15,73.8 41.14,73.79 | 27.16,39.52 25.76,39.52 25.74,39.54 v25.74,39.52
  Bottom 0.813: 41.14,73.79 v41.13,73.8 v41.13,73.81 23.76,56.44 20.64,56.44 18.09,53.89 13.84,53.89 10.49,57.24 8.09,57.24 3.99,53.14 3.94,53.14 3.24,52.44 3.24,44.14 4.05,43.33 v13.19,43.33 21.9,43.33 25.71,39.52 v25.74,39.52 | 41.14,73.79 41.32,73.79 41.34,73.81 41.16,73.81 41.14,73.79
RX
  Top 0.254: U$18.RX 27.34,53.29 29.24,51.39 29.33,51.39 U$17.RX
TX
  Top 0.254: U$18.TX 24.39,51.09 24.99,50.49 27.29,50.49 U$17.TX
VIN
  Top 0.254: SV1.5 28.43,100.48 27.16,99.21 27.16,90.32 28.43,89.05 34.78,89.05 34.78,90.32 U$18.VIN
VOUT
  Top 0.254: SV1.6 25.89,100.48 24.62,99.21 24.62,91.59 28.43,87.78 36.05,87.78 36.05,91.59 34.78,92.86 U$18.VOUT